# Altium schematic sheet TestPoints.SchDoc
size A
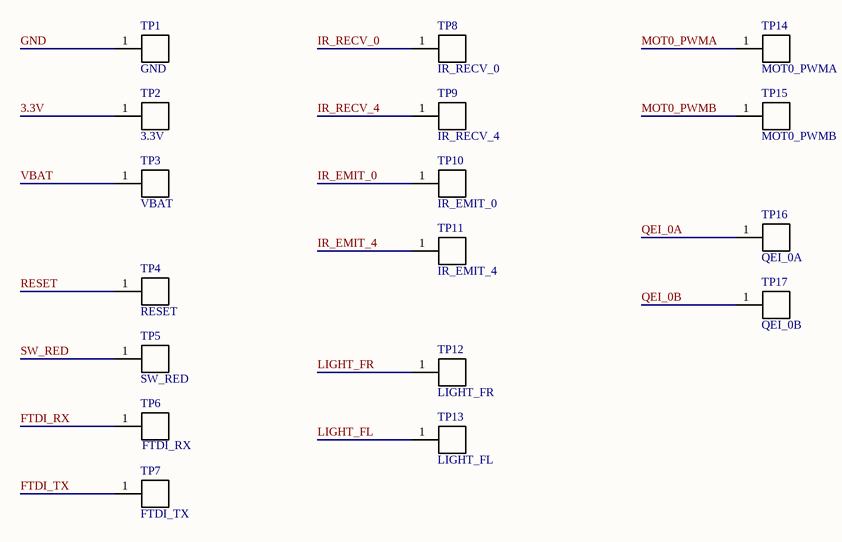
[diagram p0: TestPoints.SchDoc]

## Parts
TP1  GND  [TestPoint]
TP2  3.3V  [TestPoint]
TP3  VBAT  [TestPoint]
TP4  RESET  [TestPoint]
TP5  SW_RED  [TestPoint]
TP6  FTDI_RX  [TestPoint]
TP7  FTDI_TX  [TestPoint]
TP8  IR_RECV_0  [TestPoint]
TP9  IR_RECV_4  [TestPoint]
TP10  IR_EMIT_0  [TestPoint]
TP11  IR_EMIT_4  [TestPoint]
TP12  LIGHT_FR  [TestPoint]
TP13  LIGHT_FL  [TestPoint]
TP14  MOT0_PWMA  [TestPoint]
TP15  MOT0_PWMB  [TestPoint]
TP16  QEI_0A  [TestPoint]
TP17  QEI_0B  [TestPoint]

## Nets
3.3V: TP2.1
FTDI_RX: TP6.1
FTDI_TX: TP7.1
GND: TP1.1
IR_EMIT_0: TP10.1
IR_EMIT_4: TP11.1
IR_RECV_0: TP8.1
IR_RECV_4: TP9.1
LIGHT_FL: TP13.1
LIGHT_FR: TP12.1
MOT0_PWMA: TP14.1
MOT0_PWMB: TP15.1
QEI_0A: TP16.1
QEI_0B: TP17.1
RESET: TP4.1
SW_RED: TP5.1
VBAT: TP3.1

## Library data of the parts
TP1-TP17 = TestPoint